# EAGLE schematic c421 (EAGLE 6.6.0)

## Sheet 1 of 2
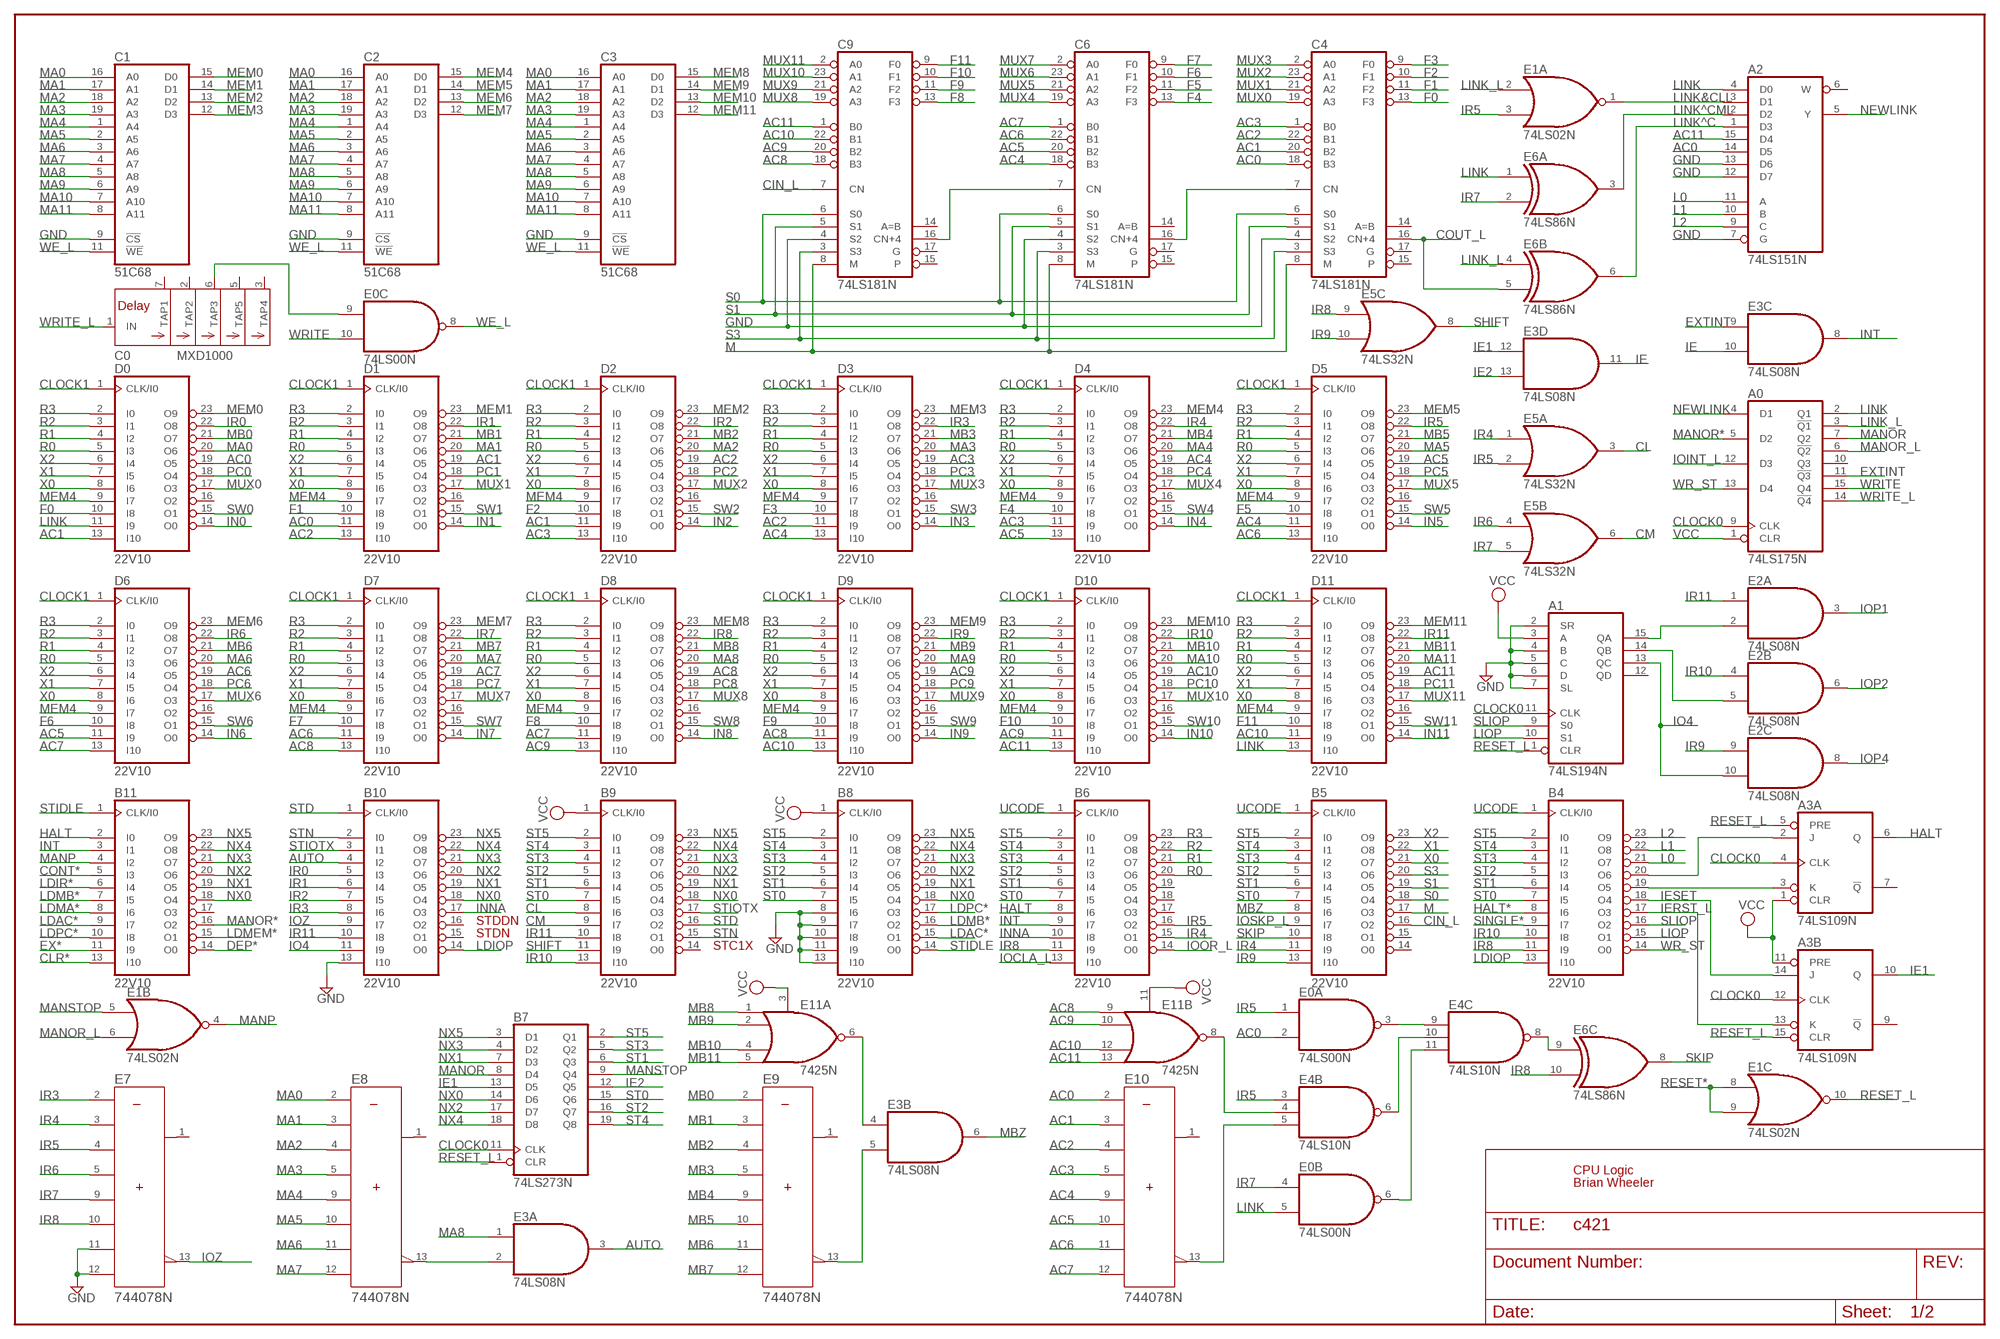
[diagram p0: schematic, sheet 1]

### Parts
A0  74LS175N  [DIL16]
A1  74LS194N  74S194N  [DIL16]
A2  74LS151N  [DIL16]
A3  74LS109N  [DIL16]
B4  22V10  [DIL24-3]
B5  22V10  [DIL24-3]
B6  22V10  [DIL24-3]
B7  74LS273N  74273N  [DIL20]
B8  22V10  [DIL24-3]
B9  22V10  [DIL24-3]
B10  22V10  [DIL24-3]
B11  22V10  [DIL24-3]
C0  MXD1000  [DIL08]
C1  51C68  [DIL20]
C2  51C68  [DIL20]
C3  51C68  [DIL20]
C4  74LS181N  [DIL24-6]
C6  74LS181N  [DIL24-6]
C9  74LS181N  [DIL24-6]
D0  22V10  [DIL24-3]
D1  22V10  [DIL24-3]
D2  22V10  [DIL24-3]
D3  22V10  [DIL24-3]
D4  22V10  [DIL24-3]
D5  22V10  [DIL24-3]
D6  22V10  [DIL24-3]
D7  22V10  [DIL24-3]
D8  22V10  [DIL24-3]
D9  22V10  [DIL24-3]
D10  22V10  [DIL24-3]
D11  22V10  [DIL24-3]
E0  74LS00N  [DIL14]
E1  74LS02N  [DIL14]
E2  74LS08N  [DIL14]
E3  74LS08N  [DIL14]
E4  74LS10N  [DIL14]
E5  74LS32N  [DIL14]
E6  74LS86N  [DIL14]
E7  744078N  [DIL14]
E8  744078N  [DIL14]
E9  744078N  [DIL14]
E10  744078N  [DIL14]
E11  7425N  [DIL14]

### Nets
AC0: A2.14(D5) C4.18(B3) D0.19(O5) D1.11(I9) E0.2(A:I1) E10.2(A) ; also sheet 2
AC1: C4.20(B2) D0.13(I10) D1.19(O5) D2.11(I9) E10.3(B) ; also sheet 2
AC2: C4.22(B1) D1.13(I10) D2.19(O5) D3.11(I9) E10.4(C) ; also sheet 2
AC3: C4.1(B0) D2.13(I10) D3.19(O5) D4.11(I9) E10.5(D) ; also sheet 2
AC4: C6.18(B3) D3.13(I10) D4.19(O5) D5.11(I9) E10.9(E) ; also sheet 2
AC5: C6.20(B2) D4.13(I10) D5.19(O5) D6.11(I9) E10.10(F) ; also sheet 2
AC6: C6.22(B1) D5.13(I10) D6.19(O5) D7.11(I9) E10.11(G) ; also sheet 2
AC7: C6.1(B0) D6.13(I10) D7.19(O5) D8.11(I9) E10.12(H) ; also sheet 2
AC8: C9.18(B3) D7.13(I10) D8.19(O5) D9.11(I9) E11.9(B:I0) ; also sheet 2
AC9: C9.20(B2) D8.13(I10) D9.19(O5) D10.11(I9) E11.10(B:I1) ; also sheet 2
AC10: C9.22(B1) D9.13(I10) D10.19(O5) D11.11(I9) E11.12(B:I2) ; also sheet 2
AC11: A2.15(D4) C9.1(B0) D10.13(I10) D11.19(O5) E11.13(B:I3) ; also sheet 2
AUTO: B10.4(I2) E3.3(A:O)
CIN_L: B5.16(O2) C9.7(CN) ; also sheet 2
CL: B9.8(I6) E5.3(A:O)
CLOCK0: A0.9(CLK) A1.11(CLK) A3.4(A:CLK) A3.12(B:CLK) B7.11(CLK) ; also sheet 2
CLOCK1: D0.1(CLK/I0) D1.1(CLK/I0) D2.1(CLK/I0) D3.1(CLK/I0) D4.1(CLK/I0) D5.1(CLK/I0) D6.1(CLK/I0) D7.1(CLK/I0) D8.1(CLK/I0) D9.1(CLK/I0) D10.1(CLK/I0) D11.1(CLK/I0) ; also sheet 2
CLR*: B11.13(I10) ; also sheet 2
CM: B9.9(I7) E5.6(B:O)
CONT*: B11.5(I3) ; also sheet 2
COUT_L: C4.16(CN+4) E6.5(B:I1)
DEP*: B11.14(O0) ; also sheet 2
EX*: B11.11(I9) ; also sheet 2
EXTINT: A0.11(!Q3) E3.9(C:I0)
F0: C4.13(F3) D0.10(I8)
F1: C4.11(F2) D1.10(I8)
F2: C4.10(F1) D2.10(I8)
F3: C4.9(F0) D3.10(I8)
F4: C6.13(F3) D4.10(I8)
F5: C6.11(F2) D5.10(I8)
F6: C6.10(F1) D6.10(I8)
F7: C6.9(F0) D7.10(I8)
F8: C9.13(F3) D8.10(I8)
F9: C9.11(F2) D9.10(I8)
F10: C9.10(F1) D10.10(I8)
F11: C9.9(F0) D11.10(I8)
GND [Power]: A1.2(SR) A1.4(B) A1.5(C) A1.6(D) A1.7(SL) A2.7(G) A2.12(D7) A2.13(D6) B8.8(I6) B8.9(I7) B8.10(I8) B8.11(I9) B8.13(I10) B10.13(I10) C1.9(!CS) C2.9(!CS) C3.9(!CS) C4.4(S2) C6.4(S2) C9.4(S2) E7.11(G) E7.12(H) ; also sheet 2
HALT: A3.6(A:Q) B6.8(I6) B11.2(I0) ; also sheet 2
HALT*: B4.8(I6) ; also sheet 2
IE: E3.10(C:I1) E3.11(D:O)
IE1: A3.10(B:Q) B7.13(D5) E3.12(D:I0)
IE2: B7.12(Q5) E3.13(D:I1)
IERST_L: A3.13(B:K) B4.17(O3)
IESET: A3.14(B:J) B4.18(O4)
IN0: D0.14(O0) ; also sheet 2
IN1: D1.14(O0) ; also sheet 2
IN2: D2.14(O0) ; also sheet 2
IN3: D3.14(O0) ; also sheet 2
IN4: D4.14(O0) ; also sheet 2
IN5: D5.14(O0) ; also sheet 2
IN6: D6.14(O0) ; also sheet 2
IN7: D7.14(O0) ; also sheet 2
IN8: D8.14(O0) ; also sheet 2
IN9: D9.14(O0) ; also sheet 2
IN10: D10.14(O0) ; also sheet 2
IN11: D11.14(O0) ; also sheet 2
INNA: B6.10(I8) B10.17(O3)
INT: B6.9(I7) B11.3(I1) E3.8(C:O)
IO4: A1.13(QC) B10.11(I9) E2.10(C:I1)
IOCLA_L: B6.13(I10) ; also sheet 2
IOINT_L: A0.12(D3) ; also sheet 2
IOOR_L: B6.14(O0) ; also sheet 2
IOP1: E2.3(A:O) ; also sheet 2
IOP2: E2.6(B:O) ; also sheet 2
IOP4: E2.8(C:O) ; also sheet 2
IOSKP_L: B5.9(I7) ; also sheet 2
IOZ: B10.9(I7) E7.13(W)
IR0: B10.5(I3) D0.22(O8) ; also sheet 2
IR1: B10.6(I4) D1.22(O8) ; also sheet 2
IR2: B10.7(I5) D2.22(O8) ; also sheet 2
IR3: B10.8(I6) D3.22(O8) E7.2(A) ; also sheet 2
IR4: B5.11(I9) B6.15(O1) D4.22(O8) E5.1(A:I0) E7.3(B) ; also sheet 2
IR5: B6.16(O2) D5.22(O8) E0.1(A:I0) E1.3(A:I1) E4.3(B:I0) E5.2(A:I1) E7.4(C) ; also sheet 2
IR6: D6.22(O8) E5.4(B:I0) E7.5(D) ; also sheet 2
IR7: D7.22(O8) E0.4(B:I0) E5.5(B:I1) E6.2(A:I1) E7.9(E) ; also sheet 2
IR8: B4.11(I9) B6.11(I9) D8.22(O8) E5.9(C:I0) E6.10(C:I1) E7.10(F) ; also sheet 2
IR9: B5.13(I10) D9.22(O8) E2.9(C:I0) E5.10(C:I1) ; also sheet 2
IR10: B4.10(I8) B9.13(I10) D10.22(O8) E2.4(B:I0) ; also sheet 2
IR11: B9.10(I8) B10.10(I8) D11.22(O8) E2.1(A:I0) ; also sheet 2
L0: A2.11(A) B4.21(O7) ; also sheet 2
L1: A2.10(B) B4.22(O8) ; also sheet 2
L2: A2.9(C) B4.23(O9) ; also sheet 2
LDAC*: B8.15(O1) B11.9(I7) ; also sheet 2
LDIOP: B4.13(I10) B10.14(O0)
LDIR*: B11.6(I4) ; also sheet 2
LDMA*: B11.8(I6) ; also sheet 2
LDMB*: B8.16(O2) B11.7(I5) ; also sheet 2
LDMEM*: B11.15(O1) ; also sheet 2
LDPC*: B8.17(O3) B11.10(I8) ; also sheet 2
LINK: A0.2(Q1) A2.4(D0) D0.11(I9) D11.13(I10) E0.5(B:I1) E6.1(A:I0) ; also sheet 2
LINK&CLL: A2.3(D1) E1.1(A:O)
LINK^C: A2.1(D3) E6.6(B:O)
LINK^CML: A2.2(D2) E6.3(A:O)
LINK_L: A0.3(!Q1) E1.2(A:I0) E6.4(B:I0)
LIOP: A1.10(S1) B4.15(O1)
M: B5.17(O3) C4.8(M) C6.8(M) C9.8(M) ; also sheet 2
MA0: C1.16(A0) C2.16(A0) C3.16(A0) D0.20(O6) E8.2(A) ; also sheet 2
MA1: C1.17(A1) C2.17(A1) C3.17(A1) D1.20(O6) E8.3(B) ; also sheet 2
MA2: C1.18(A2) C2.18(A2) C3.18(A2) D2.20(O6) E8.4(C) ; also sheet 2
MA3: C1.19(A3) C2.19(A3) C3.19(A3) D3.20(O6) E8.5(D) ; also sheet 2
MA4: C1.1(A4) C2.1(A4) C3.1(A4) D4.20(O6) E8.9(E) ; also sheet 2
MA5: C1.2(A5) C2.2(A5) C3.2(A5) D5.20(O6) E8.10(F) ; also sheet 2
MA6: C1.3(A6) C2.3(A6) C3.3(A6) D6.20(O6) E8.11(G) ; also sheet 2
MA7: C1.4(A7) C2.4(A7) C3.4(A7) D7.20(O6) E8.12(H) ; also sheet 2
MA8: C1.5(A8) C2.5(A8) C3.5(A8) D8.20(O6) E3.1(A:I0) ; also sheet 2
MA9: C1.6(A9) C2.6(A9) C3.6(A9) D9.20(O6) ; also sheet 2
MA10: C1.7(A10) C2.7(A10) C3.7(A10) D10.20(O6) ; also sheet 2
MA11: C1.8(A11) C2.8(A11) C3.8(A11) D11.20(O6) ; also sheet 2
MANOR: A0.7(Q2) B7.8(D4)
MANOR*: A0.5(D2) B11.16(O2) ; also sheet 2
MANOR_L: A0.6(!Q2) E1.6(B:I1)
MANP: B11.4(I2) E1.4(B:O)
MANSTOP: B7.9(Q4) E1.5(B:I0)
MB0: D0.21(O7) E9.2(A) ; also sheet 2
MB1: D1.21(O7) E9.3(B) ; also sheet 2
MB2: D2.21(O7) E9.4(C) ; also sheet 2
MB3: D3.21(O7) E9.5(D) ; also sheet 2
MB4: D4.21(O7) E9.9(E) ; also sheet 2
MB5: D5.21(O7) E9.10(F) ; also sheet 2
MB6: D6.21(O7) E9.11(G) ; also sheet 2
MB7: D7.21(O7) E9.12(H) ; also sheet 2
MB8: D8.21(O7) E11.1(A:I0) ; also sheet 2
MB9: D9.21(O7) E11.2(A:I1) ; also sheet 2
MB10: D10.21(O7) E11.4(A:I2) ; also sheet 2
MB11: D11.21(O7) E11.5(A:I3) ; also sheet 2
MBZ: B5.8(I6) E3.6(B:O)
MEM0: C1.15(D0) D0.23(O9) ; also sheet 2
MEM1: C1.14(D1) D1.23(O9) ; also sheet 2
MEM2: C1.13(D2) D2.23(O9) ; also sheet 2
MEM3: C1.12(D3) D3.23(O9) ; also sheet 2
MEM4: C2.15(D0) D0.9(I7) D1.9(I7) D2.9(I7) D3.9(I7) D4.9(I7) D4.23(O9) D5.9(I7) D6.9(I7) D7.9(I7) D8.9(I7) D9.9(I7) D10.9(I7) D11.9(I7) ; also sheet 2
MEM5: C2.14(D1) D5.23(O9) ; also sheet 2
MEM6: C2.13(D2) D6.23(O9) ; also sheet 2
MEM7: C2.12(D3) D7.23(O9) ; also sheet 2
MEM8: C3.15(D0) D8.23(O9) ; also sheet 2
MEM9: C3.14(D1) D9.23(O9) ; also sheet 2
MEM10: C3.13(D2) D10.23(O9) ; also sheet 2
MEM11: C3.12(D3) D11.23(O9) ; also sheet 2
MUX0: C4.19(A3) D0.17(O3)
MUX1: C4.21(A2) D1.17(O3)
MUX2: C4.23(A1) D2.17(O3)
MUX3: C4.2(A0) D3.17(O3)
MUX4: C6.19(A3) D4.17(O3)
MUX5: C6.21(A2) D5.17(O3)
MUX6: C6.23(A1) D6.17(O3)
MUX7: C6.2(A0) D7.17(O3)
MUX8: C9.19(A3) D8.17(O3)
MUX9: C9.21(A2) D9.17(O3)
MUX10: C9.23(A1) D10.17(O3)
MUX11: C9.2(A0) D11.17(O3)
N$1: C4.7(CN) C6.16(CN+4)
N$2: E3.2(A:I1) E8.13(W)
N$3: E4.4(B:I1) E11.8(B:O)
N$4: E4.5(B:I2) E10.13(W)
N$5: E4.8(C:O) E6.9(C:I0)
N$6: C0.6(TAP3) E0.9(C:I0)
N$7: E3.4(B:I0) E11.6(A:O)
N$8: E3.5(B:I1) E9.13(W)
N$9: A1.15(QA) E2.2(A:I1)
N$10: A1.14(QB) E2.5(B:I1)
N$11: E0.6(B:O) E4.11(C:I2)
N$12: E4.6(B:O) E4.10(C:I1)
N$13: E0.3(A:O) E4.9(C:I0)
N$15: C6.7(CN) C9.16(CN+4)
N$17: A3.3(A:K) B4.19(O5)
N$18: A3.2(A:J) B4.20(O6)
NEWLINK: A0.4(D1) A2.5(Y)
NX0: B7.14(D6) B8.18(O4) B9.18(O4) B10.18(O4) B11.18(O4) ; also sheet 2
NX1: B7.7(D3) B8.19(O5) B9.19(O5) B10.19(O5) B11.19(O5) ; also sheet 2
NX2: B7.17(D7) B8.20(O6) B9.20(O6) B10.20(O6) B11.20(O6) ; also sheet 2
NX3: B7.4(D2) B8.21(O7) B9.21(O7) B10.21(O7) B11.21(O7) ; also sheet 2
NX4: B7.18(D8) B8.22(O8) B9.22(O8) B10.22(O8) B11.22(O8) ; also sheet 2
NX5: B7.3(D1) B8.23(O9) B9.23(O9) B10.23(O9) B11.23(O9) ; also sheet 2
PC0: D0.18(O4) ; also sheet 2
PC1: D1.18(O4) ; also sheet 2
PC2: D2.18(O4) ; also sheet 2
PC3: D3.18(O4) ; also sheet 2
PC4: D4.18(O4) ; also sheet 2
PC5: D5.18(O4) ; also sheet 2
PC6: D6.18(O4) ; also sheet 2
PC7: D7.18(O4) ; also sheet 2
PC8: D8.18(O4) ; also sheet 2
PC9: D9.18(O4) ; also sheet 2
PC10: D10.18(O4) ; also sheet 2
PC11: D11.18(O4) ; also sheet 2
R0: B6.20(O6) D0.5(I3) D1.5(I3) D2.5(I3) D3.5(I3) D4.5(I3) D5.5(I3) D6.5(I3) D7.5(I3) D8.5(I3) D9.5(I3) D10.5(I3) D11.5(I3) ; also sheet 2
R1: B6.21(O7) D0.4(I2) D1.4(I2) D2.4(I2) D3.4(I2) D4.4(I2) D5.4(I2) D6.4(I2) D7.4(I2) D8.4(I2) D9.4(I2) D10.4(I2) D11.4(I2) ; also sheet 2
R2: B6.22(O8) D0.3(I1) D1.3(I1) D2.3(I1) D3.3(I1) D4.3(I1) D5.3(I1) D6.3(I1) D7.3(I1) D8.3(I1) D9.3(I1) D10.3(I1) D11.3(I1) ; also sheet 2
R3: B6.23(O9) D0.2(I0) D1.2(I0) D2.2(I0) D3.2(I0) D4.2(I0) D5.2(I0) D6.2(I0) D7.2(I0) D8.2(I0) D9.2(I0) D10.2(I0) D11.2(I0) ; also sheet 2
RESET*: E1.8(C:I0) E1.9(C:I1) ; also sheet 2
RESET_L: A1.1(CLR) A3.5(A:PRE) A3.15(B:CLR) B7.1(CLR) E1.10(C:O)
S0: B5.18(O4) C4.6(S0) C6.6(S0) C9.6(S0) ; also sheet 2
S1: B5.19(O5) C4.5(S1) C6.5(S1) C9.5(S1) ; also sheet 2
S3: B5.20(O6) C4.3(S3) C6.3(S3) C9.3(S3) ; also sheet 2
SHIFT: B9.11(I9) E5.8(C:O)
SINGLE*: B4.9(I7) ; also sheet 2
SKIP: B5.10(I8) E6.8(C:O)
SLIOP: A1.9(S0) B4.16(O2)
ST0: B4.7(I5) B5.7(I5) B6.7(I5) B7.15(Q6) B8.7(I5) B9.7(I5) ; also sheet 2
ST1: B4.6(I4) B5.6(I4) B6.6(I4) B7.6(Q3) B8.6(I4) B9.6(I4) ; also sheet 2
ST2: B4.5(I3) B5.5(I3) B6.5(I3) B7.16(Q7) B8.5(I3) B9.5(I3) ; also sheet 2
ST3: B4.4(I2) B5.4(I2) B6.4(I2) B7.5(Q2) B8.4(I2) B9.4(I2) ; also sheet 2
ST4: B4.3(I1) B5.3(I1) B6.3(I1) B7.19(Q8) B8.3(I1) B9.3(I1) ; also sheet 2
ST5: B4.2(I0) B5.2(I0) B6.2(I0) B7.2(Q1) B8.2(I0) B9.2(I0) ; also sheet 2
STD: B9.16(O2) B10.1(CLK/I0)
STIDLE: B8.14(O0) B11.1(CLK/I0)
STIOTX: B9.17(O3) B10.3(I1)
STN: B9.15(O1) B10.2(I0)
SW0: D0.15(O1) ; also sheet 2
SW1: D1.15(O1) ; also sheet 2
SW2: D2.15(O1) ; also sheet 2
SW3: D3.15(O1) ; also sheet 2
SW4: D4.15(O1) ; also sheet 2
SW5: D5.15(O1) ; also sheet 2
SW6: D6.15(O1) ; also sheet 2
SW7: D7.15(O1) ; also sheet 2
SW8: D8.15(O1) ; also sheet 2
SW9: D9.15(O1) ; also sheet 2
SW10: D10.15(O1) ; also sheet 2
SW11: D11.15(O1) ; also sheet 2
UCODE: B4.1(CLK/I0) B5.1(CLK/I0) B6.1(CLK/I0) ; also sheet 2
VCC [Power]: A0.1(CLR) A1.3(A) A3.1(A:CLR) A3.11(B:PRE) B8.1(CLK/I0) B9.1(CLK/I0) E11.3(A:G) E11.11(B:G) ; also sheet 2
WE_L: C1.11(!WE) C2.11(!WE) C3.11(!WE) E0.8(C:O)
WR_ST: A0.13(D4) B4.14(O0)
WRITE: A0.15(Q4) E0.10(C:I1)
WRITE_L: A0.14(!Q4) C0.1(IN)
X0: B5.21(O7) D0.8(I6) D1.8(I6) D2.8(I6) D3.8(I6) D4.8(I6) D5.8(I6) D6.8(I6) D7.8(I6) D8.8(I6) D9.8(I6) D10.8(I6) D11.8(I6) ; also sheet 2
X1: B5.22(O8) D0.7(I5) D1.7(I5) D2.7(I5) D3.7(I5) D4.7(I5) D5.7(I5) D6.7(I5) D7.7(I5) D8.7(I5) D9.7(I5) D10.7(I5) D11.7(I5) ; also sheet 2
X2: B5.23(O9) D0.6(I4) D1.6(I4) D2.6(I4) D3.6(I4) D4.6(I4) D5.6(I4) D6.6(I4) D7.6(I4) D8.6(I4) D9.6(I4) D10.6(I4) D11.6(I4) ; also sheet 2
Unconnected: A0.10(Q3) A1.12(QD) A2.6(W) A3.7(A:!Q) A3.9(B:!Q) B5.14(O0) B5.15(O1) B6.17(O3) B6.18(O4) B6.19(O5) B9.14(O0) B10.15(O1) B10.16(O2) B11.17(O3) C0.2(TAP2) C0.3(TAP4) C0.5(TAP5) C0.7(TAP1) C4.14(A=B) C4.15(P) C4.17(G) C6.14(A=B) C6.15(P) C6.17(G) C9.14(A=B) C9.15(P) C9.17(G) D0.16(O2) D1.16(O2) D2.16(O2) D3.16(O2) D4.16(O2) D5.16(O2) D6.16(O2) D7.16(O2) D8.16(O2) D9.16(O2) D10.16(O2) D11.16(O2) E0.11(D:O) E0.12(D:I0) E0.13(D:I1) E1.11(D:I0) E1.12(D:I1) E1.13(D:O) E2.11(D:O) E2.12(D:I0) E2.13(D:I1) E4.1(A:I0) E4.2(A:I1) E4.12(A:O) E4.13(A:I2) E5.11(D:O) E5.12(D:I0) E5.13(D:I1) E6.11(D:O) E6.12(D:I0) E6.13(D:I1) E7.1(Y) E8.1(Y) E9.1(Y) E10.1(Y)

### Notes on the sheet
- STDDN
- STDN
- STC1X
- CPU Logic
- Brian Wheeler

## Sheet 2 of 2
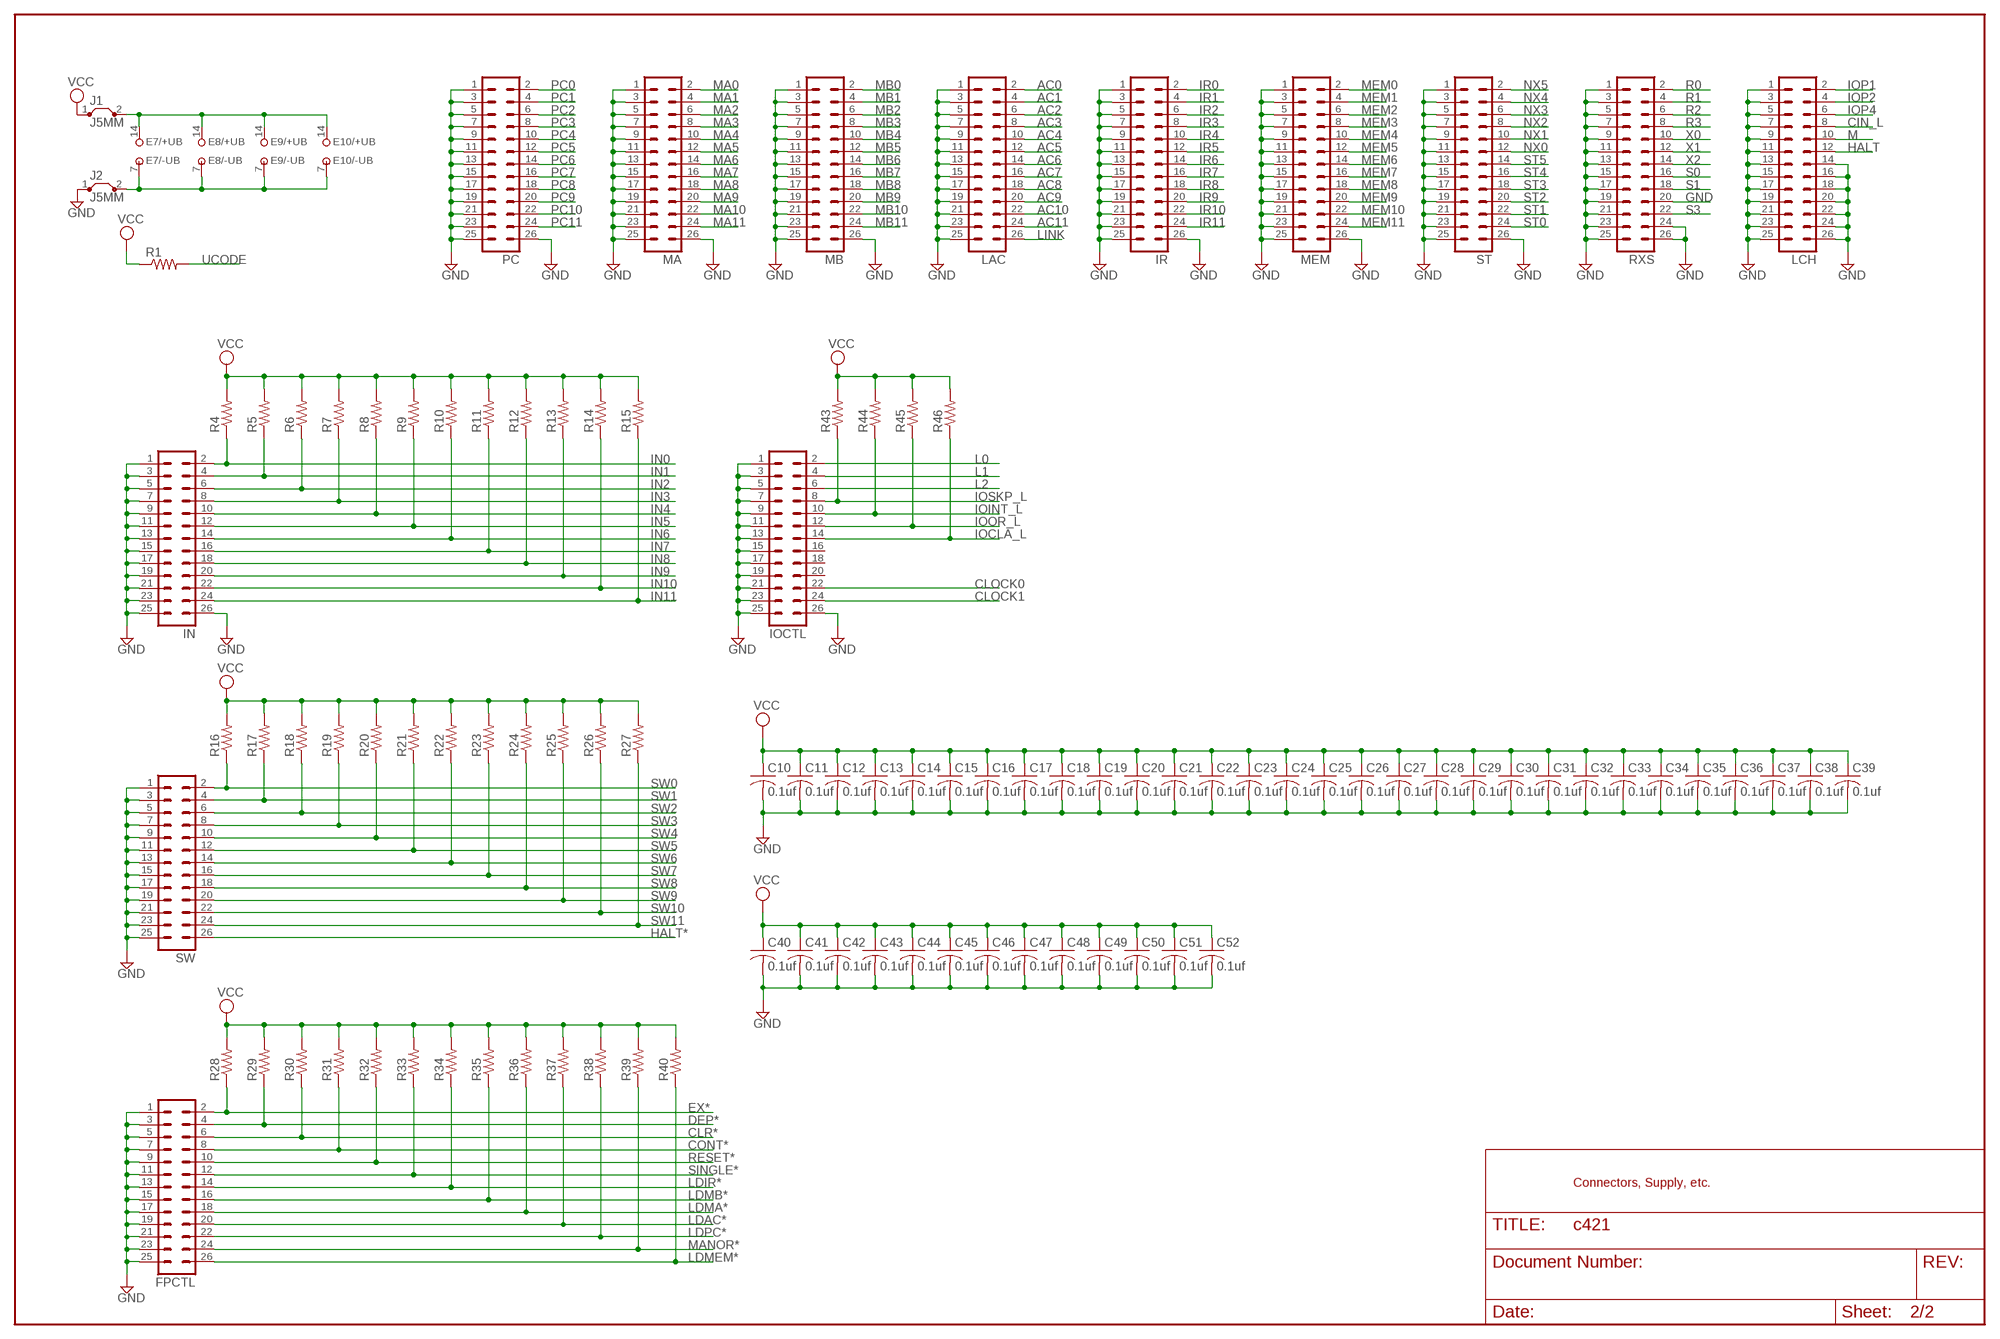
[diagram p1: schematic, sheet 2]

### Parts
C10  0.1uf  C-US050-025X075  [C050-025X075]
C11  0.1uf  C-US050-025X075  [C050-025X075]
C12  0.1uf  C-US050-025X075  [C050-025X075]
C13  0.1uf  C-US050-025X075  [C050-025X075]
C14  0.1uf  C-US050-025X075  [C050-025X075]
C15  0.1uf  C-US050-025X075  [C050-025X075]
C16  0.1uf  C-US050-025X075  [C050-025X075]
C17  0.1uf  C-US050-025X075  [C050-025X075]
C18  0.1uf  C-US050-025X075  [C050-025X075]
C19  0.1uf  C-US050-025X075  [C050-025X075]
C20  0.1uf  C-US050-025X075  [C050-025X075]
C21  0.1uf  C-US050-025X075  [C050-025X075]
C22  0.1uf  C-US050-025X075  [C050-025X075]
C23  0.1uf  C-US050-025X075  [C050-025X075]
C24  0.1uf  C-US050-025X075  [C050-025X075]
C25  0.1uf  C-US050-025X075  [C050-025X075]
C26  0.1uf  C-US050-025X075  [C050-025X075]
C27  0.1uf  C-US050-025X075  [C050-025X075]
C28  0.1uf  C-US050-025X075  [C050-025X075]
C29  0.1uf  C-US050-025X075  [C050-025X075]
C30  0.1uf  C-US050-025X075  [C050-025X075]
C31  0.1uf  C-US050-025X075  [C050-025X075]
C32  0.1uf  C-US050-025X075  [C050-025X075]
C33  0.1uf  C-US050-025X075  [C050-025X075]
C34  0.1uf  C-US050-025X075  [C050-025X075]
C35  0.1uf  C-US050-025X075  [C050-025X075]
C36  0.1uf  C-US050-025X075  [C050-025X075]
C37  0.1uf  C-US050-025X075  [C050-025X075]
C38  0.1uf  C-US050-025X075  [C050-025X075]
C39  0.1uf  C-US050-025X075  [C050-025X075]
C40  0.1uf  C-US050-025X075  [C050-025X075]
C41  0.1uf  C-US050-025X075  [C050-025X075]
C42  0.1uf  C-US050-025X075  [C050-025X075]
C43  0.1uf  C-US050-025X075  [C050-025X075]
C44  0.1uf  C-US050-025X075  [C050-025X075]
C45  0.1uf  C-US050-025X075  [C050-025X075]
C46  0.1uf  C-US050-025X075  [C050-025X075]
C47  0.1uf  C-US050-025X075  [C050-025X075]
C48  0.1uf  C-US050-025X075  [C050-025X075]
C49  0.1uf  C-US050-025X075  [C050-025X075]
C50  0.1uf  C-US050-025X075  [C050-025X075]
C51  0.1uf  C-US050-025X075  [C050-025X075]
C52  0.1uf  C-US050-025X075  [C050-025X075]
FPCTL  ML26  [ML26]
IN  ML26  [ML26]
IOCTL  ML26  [ML26]
IR  ML26  [ML26]
J1  J5MM  [05]
J2  J5MM  [05]
LAC  ML26  [ML26]
LCH  ML26  [ML26]
MA  ML26  [ML26]
MB  ML26  [ML26]
MEM  ML26  [ML26]
PC  ML26  [ML26]
R1  R-US_0207/10  [0207/10]
R4  R-US_0207/10  [0207/10]
R5  R-US_0207/10  [0207/10]
R6  R-US_0207/10  [0207/10]
R7  R-US_0207/10  [0207/10]
R8  R-US_0207/10  [0207/10]
R9  R-US_0207/10  [0207/10]
R10  R-US_0207/10  [0207/10]
R11  R-US_0207/10  [0207/10]
R12  R-US_0207/10  [0207/10]
R13  R-US_0207/10  [0207/10]
R14  R-US_0207/10  [0207/10]
R15  R-US_0207/10  [0207/10]
R16  R-US_0207/10  [0207/10]
R17  R-US_0207/10  [0207/10]
R18  R-US_0207/10  [0207/10]
R19  R-US_0207/10  [0207/10]
R20  R-US_0207/10  [0207/10]
R21  R-US_0207/10  [0207/10]
R22  R-US_0207/10  [0207/10]
R23  R-US_0207/10  [0207/10]
R24  R-US_0207/10  [0207/10]
R25  R-US_0207/10  [0207/10]
R26  R-US_0207/10  [0207/10]
R27  R-US_0207/10  [0207/10]
R28  R-US_0207/10  [0207/10]
R29  R-US_0207/10  [0207/10]
R30  R-US_0207/10  [0207/10]
R31  R-US_0207/10  [0207/10]
R32  R-US_0207/10  [0207/10]
R33  R-US_0207/10  [0207/10]
R34  R-US_0207/10  [0207/10]
R35  R-US_0207/10  [0207/10]
R36  R-US_0207/10  [0207/10]
R37  R-US_0207/10  [0207/10]
R38  R-US_0207/10  [0207/10]
R39  R-US_0207/10  [0207/10]
R40  R-US_0207/10  [0207/10]
R43  R-US_0207/10  [0207/10]
R44  R-US_0207/10  [0207/10]
R45  R-US_0207/10  [0207/10]
R46  R-US_0207/10  [0207/10]
RXS  ML26  [ML26]
ST  ML26  [ML26]
SW  ML26  [ML26]

### Nets
+UB [Power]: E7.14(+UB) E8.14(+UB) E9.14(+UB) E10.14(+UB) J1.2
-UB [Power]: E7.7(-UB) E8.7(-UB) E9.7(-UB) E10.7(-UB) J2.2
AC0: LAC.2 ; also sheet 1
AC1: LAC.4 ; also sheet 1
AC2: LAC.6 ; also sheet 1
AC3: LAC.8 ; also sheet 1
AC4: LAC.10 ; also sheet 1
AC5: LAC.12 ; also sheet 1
AC6: LAC.14 ; also sheet 1
AC7: LAC.16 ; also sheet 1
AC8: LAC.18 ; also sheet 1
AC9: LAC.20 ; also sheet 1
AC10: LAC.22 ; also sheet 1
AC11: LAC.24 ; also sheet 1
CIN_L: LCH.8 ; also sheet 1
CLOCK0: IOCTL.22 ; also sheet 1
CLOCK1: IOCTL.24 ; also sheet 1
CLR*: FPCTL.6 R30.1 ; also sheet 1
CONT*: FPCTL.8 R31.1 ; also sheet 1
DEP*: FPCTL.4 R29.1 ; also sheet 1
EX*: FPCTL.2 R28.1 ; also sheet 1
GND [Power]: C10.2 C11.2 C12.2 C13.2 C14.2 C15.2 C16.2 C17.2 C18.2 C19.2 C20.2 C21.2 C22.2 C23.2 C24.2 C25.2 C26.2 C27.2 C28.2 C29.2 C30.2 C31.2 C32.2 C33.2 C34.2 C35.2 C36.2 C37.2 C38.2 C39.2 C40.2 C41.2 C42.2 C43.2 C44.2 C45.2 C46.2 C47.2 C48.2 C49.2 C50.2 C51.2 C52.2 FPCTL.1 FPCTL.3 FPCTL.5 FPCTL.7 FPCTL.9 FPCTL.11 FPCTL.13 FPCTL.15 FPCTL.17 FPCTL.19 FPCTL.21 FPCTL.23 FPCTL.25 IN.1 IN.3 IN.5 IN.7 IN.9 IN.11 IN.13 IN.15 IN.17 IN.19 IN.21 IN.23 IN.25 IN.26 IOCTL.1 IOCTL.3 IOCTL.5 IOCTL.7 IOCTL.9 IOCTL.11 IOCTL.13 IOCTL.15 IOCTL.17 IOCTL.19 IOCTL.21 IOCTL.23 IOCTL.25 IOCTL.26 IR.1 IR.3 IR.5 IR.7 IR.9 IR.11 IR.13 IR.15 IR.17 IR.19 IR.21 IR.23 IR.25 IR.26 J2.1 LAC.1 LAC.3 LAC.5 LAC.7 LAC.9 LAC.11 LAC.13 LAC.15 LAC.17 LAC.19 LAC.21 LAC.23 LAC.25 LCH.1 LCH.3 LCH.5 LCH.7 LCH.9 LCH.11 LCH.13 LCH.14 LCH.15 LCH.16 LCH.17 LCH.18 LCH.19 LCH.20 LCH.21 LCH.22 LCH.23 LCH.24 LCH.25 LCH.26 MA.1 MA.3 MA.5 MA.7 MA.9 MA.11 MA.13 MA.15 MA.17 MA.19 MA.21 MA.23 MA.25 MA.26 MB.1 MB.3 MB.5 MB.7 MB.9 MB.11 MB.13 MB.15 MB.17 MB.19 MB.21 MB.23 MB.25 MB.26 MEM.1 MEM.3 MEM.5 MEM.7 MEM.9 MEM.11 MEM.13 MEM.15 MEM.17 MEM.19 MEM.21 MEM.23 MEM.25 MEM.26 PC.1 PC.3 PC.5 PC.7 PC.9 PC.11 PC.13 PC.15 PC.17 PC.19 PC.21 PC.23 PC.25 PC.26 RXS.1 RXS.3 RXS.5 RXS.7 RXS.9 RXS.11 RXS.13 RXS.15 RXS.17 RXS.19 RXS.20 RXS.21 RXS.23 RXS.24 RXS.25 RXS.26 ST.1 ST.3 ST.5 ST.7 ST.9 ST.11 ST.13 ST.15 ST.17 ST.19 ST.21 ST.23 ST.25 ST.26 SW.1 SW.3 SW.5 SW.7 SW.9 SW.11 SW.13 SW.15 SW.17 SW.19 SW.21 SW.23 SW.25 ; also sheet 1
HALT: LCH.12 ; also sheet 1
HALT*: SW.26 ; also sheet 1
IN0: IN.2 R4.1 ; also sheet 1
IN1: IN.4 R5.1 ; also sheet 1
IN2: IN.6 R6.1 ; also sheet 1
IN3: IN.8 R7.1 ; also sheet 1
IN4: IN.10 R8.1 ; also sheet 1
IN5: IN.12 R9.1 ; also sheet 1
IN6: IN.14 R10.1 ; also sheet 1
IN7: IN.16 R11.1 ; also sheet 1
IN8: IN.18 R12.1 ; also sheet 1
IN9: IN.20 R13.1 ; also sheet 1
IN10: IN.22 R14.1 ; also sheet 1
IN11: IN.24 R15.1 ; also sheet 1
IOCLA_L: IOCTL.14 R46.1 ; also sheet 1
IOINT_L: IOCTL.10 R44.1 ; also sheet 1
IOOR_L: IOCTL.12 R45.1 ; also sheet 1
IOP1: LCH.2 ; also sheet 1
IOP2: LCH.4 ; also sheet 1
IOP4: LCH.6 ; also sheet 1
IOSKP_L: IOCTL.8 R43.1 ; also sheet 1
IR0: IR.2 ; also sheet 1
IR1: IR.4 ; also sheet 1
IR2: IR.6 ; also sheet 1
IR3: IR.8 ; also sheet 1
IR4: IR.10 ; also sheet 1
IR5: IR.12 ; also sheet 1
IR6: IR.14 ; also sheet 1
IR7: IR.16 ; also sheet 1
IR8: IR.18 ; also sheet 1
IR9: IR.20 ; also sheet 1
IR10: IR.22 ; also sheet 1
IR11: IR.24 ; also sheet 1
L0: IOCTL.2 ; also sheet 1
L1: IOCTL.4 ; also sheet 1
L2: IOCTL.6 ; also sheet 1
LDAC*: FPCTL.20 R37.1 ; also sheet 1
LDIR*: FPCTL.14 R34.1 ; also sheet 1
LDMA*: FPCTL.18 R36.1 ; also sheet 1
LDMB*: FPCTL.16 R35.1 ; also sheet 1
LDMEM*: FPCTL.26 R40.1 ; also sheet 1
LDPC*: FPCTL.22 R38.1 ; also sheet 1
LINK: LAC.26 ; also sheet 1
M: LCH.10 ; also sheet 1
MA0: MA.2 ; also sheet 1
MA1: MA.4 ; also sheet 1
MA2: MA.6 ; also sheet 1
MA3: MA.8 ; also sheet 1
MA4: MA.10 ; also sheet 1
MA5: MA.12 ; also sheet 1
MA6: MA.14 ; also sheet 1
MA7: MA.16 ; also sheet 1
MA8: MA.18 ; also sheet 1
MA9: MA.20 ; also sheet 1
MA10: MA.22 ; also sheet 1
MA11: MA.24 ; also sheet 1
MANOR*: FPCTL.24 R39.1 ; also sheet 1
MB0: MB.2 ; also sheet 1
MB1: MB.4 ; also sheet 1
MB2: MB.6 ; also sheet 1
MB3: MB.8 ; also sheet 1
MB4: MB.10 ; also sheet 1
MB5: MB.12 ; also sheet 1
MB6: MB.14 ; also sheet 1
MB7: MB.16 ; also sheet 1
MB8: MB.18 ; also sheet 1
MB9: MB.20 ; also sheet 1
MB10: MB.22 ; also sheet 1
MB11: MB.24 ; also sheet 1
MEM0: MEM.2 ; also sheet 1
MEM1: MEM.4 ; also sheet 1
MEM2: MEM.6 ; also sheet 1
MEM3: MEM.8 ; also sheet 1
MEM4: MEM.10 ; also sheet 1
MEM5: MEM.12 ; also sheet 1
MEM6: MEM.14 ; also sheet 1
MEM7: MEM.16 ; also sheet 1
MEM8: MEM.18 ; also sheet 1
MEM9: MEM.20 ; also sheet 1
MEM10: MEM.22 ; also sheet 1
MEM11: MEM.24 ; also sheet 1
NX0: ST.12 ; also sheet 1
NX1: ST.10 ; also sheet 1
NX2: ST.8 ; also sheet 1
NX3: ST.6 ; also sheet 1
NX4: ST.4 ; also sheet 1
NX5: ST.2 ; also sheet 1
PC0: PC.2 ; also sheet 1
PC1: PC.4 ; also sheet 1
PC2: PC.6 ; also sheet 1
PC3: PC.8 ; also sheet 1
PC4: PC.10 ; also sheet 1
PC5: PC.12 ; also sheet 1
PC6: PC.14 ; also sheet 1
PC7: PC.16 ; also sheet 1
PC8: PC.18 ; also sheet 1
PC9: PC.20 ; also sheet 1
PC10: PC.22 ; also sheet 1
PC11: PC.24 ; also sheet 1
R0: RXS.2 ; also sheet 1
R1: RXS.4 ; also sheet 1
R2: RXS.6 ; also sheet 1
R3: RXS.8 ; also sheet 1
RESET*: FPCTL.10 R32.1 ; also sheet 1
S0: RXS.16 ; also sheet 1
S1: RXS.18 ; also sheet 1
S3: RXS.22 ; also sheet 1
SINGLE*: FPCTL.12 R33.1 ; also sheet 1
ST0: ST.24 ; also sheet 1
ST1: ST.22 ; also sheet 1
ST2: ST.20 ; also sheet 1
ST3: ST.18 ; also sheet 1
ST4: ST.16 ; also sheet 1
ST5: ST.14 ; also sheet 1
SW0: R16.1 SW.2 ; also sheet 1
SW1: R17.1 SW.4 ; also sheet 1
SW2: R18.1 SW.6 ; also sheet 1
SW3: R19.1 SW.8 ; also sheet 1
SW4: R20.1 SW.10 ; also sheet 1
SW5: R21.1 SW.12 ; also sheet 1
SW6: R22.1 SW.14 ; also sheet 1
SW7: R23.1 SW.16 ; also sheet 1
SW8: R24.1 SW.18 ; also sheet 1
SW9: R25.1 SW.20 ; also sheet 1
SW10: R26.1 SW.22 ; also sheet 1
SW11: R27.1 SW.24 ; also sheet 1
UCODE: R1.2 ; also sheet 1
VCC [Power]: C10.1 C11.1 C12.1 C13.1 C14.1 C15.1 C16.1 C17.1 C18.1 C19.1 C20.1 C21.1 C22.1 C23.1 C24.1 C25.1 C26.1 C27.1 C28.1 C29.1 C30.1 C31.1 C32.1 C33.1 C34.1 C35.1 C36.1 C37.1 C38.1 C39.1 C40.1 C41.1 C42.1 C43.1 C44.1 C45.1 C46.1 C47.1 C48.1 C49.1 C50.1 C51.1 C52.1 J1.1 R1.1 R4.2 R5.2 R6.2 R7.2 R8.2 R9.2 R10.2 R11.2 R12.2 R13.2 R14.2 R15.2 R16.2 R17.2 R18.2 R19.2 R20.2 R21.2 R22.2 R23.2 R24.2 R25.2 R26.2 R27.2 R28.2 R29.2 R30.2 R31.2 R32.2 R33.2 R34.2 R35.2 R36.2 R37.2 R38.2 R39.2 R40.2 R43.2 R44.2 R45.2 R46.2 ; also sheet 1
X0: RXS.10 ; also sheet 1
X1: RXS.12 ; also sheet 1
X2: RXS.14 ; also sheet 1
Unconnected: IOCTL.16 IOCTL.18 IOCTL.20

### Notes on the sheet
- Connectors, Supply, etc.

## Power pins joined to a net without a drawn wire
GND: A0.8(GND) A1.8(GND) A2.8(GND) A3.8(P:GND) B4.12(GND) B5.12(GND) B6.12(GND) B7.10(GND) B8.12(GND) B9.12(GND) B10.12(GND) B11.12(GND) C0.4(GND) C1.10(GND) C2.10(GND) C3.10(GND) C4.12(GND) C6.12(GND) C9.12(GND) D0.12(GND) D1.12(GND) D2.12(GND) D3.12(GND) D4.12(GND) D5.12(GND) D6.12(GND) D7.12(GND) D8.12(GND) D9.12(GND) D10.12(GND) D11.12(GND) E0.7(P:GND) E1.7(P:GND) E2.7(P:GND) E3.7(P:GND) E4.7(P:GND) E5.7(P:GND) E6.7(P:GND) E11.7(P:GND)
VCC: A0.16(VCC) A1.16(VCC) A2.16(VCC) A3.16(P:VCC) B4.24(VCC) B5.24(VCC) B6.24(VCC) B7.20(VCC) B8.24(VCC) B9.24(VCC) B10.24(VCC) B11.24(VCC) C0.8(VCC) C1.20(VCC) C2.20(VCC) C3.20(VCC) C4.24(VCC) C6.24(VCC) C9.24(VCC) D0.24(VCC) D1.24(VCC) D2.24(VCC) D3.24(VCC) D4.24(VCC) D5.24(VCC) D6.24(VCC) D7.24(VCC) D8.24(VCC) D9.24(VCC) D10.24(VCC) D11.24(VCC) E0.14(P:VCC) E1.14(P:VCC) E2.14(P:VCC) E3.14(P:VCC) E4.14(P:VCC) E5.14(P:VCC) E6.14(P:VCC) E11.14(P:VCC)

## Library data of the parts
A0 = 74xx-us:74*175: Qadruple D type FLIP FLOP, clear
A1 = 74xx-us:74*194: 4-bit bidirectional SHIFT REGISTER
A2 = 74xx-us:74*151: Data SELECTOR/MULTIPLEXER
A3 = 74xx-us:74*109: Dual J-K positive edge triggered FLIP FLOP, preset and clear
B4-B6 B8-B11 D0 D1-D11 = pal:22V10: PAL; MPN: GAL22V10D-7LPN; OC_FARNELL: 1571925; OC_NEWARK: 97M0480
B7 = 74xx-us:74*273: Octal D type FLIP FLOP, clear
C0 = maxim:MXD1000: DELAY LINE; OC_FARNELL: unknown; OC_NEWARK: unknown
C1-C3 = memory:51C68: MEMORY
C4 C6 C9 = 74xx-us:74*181: ARITHMETIC LOGIC UNIT function generator
C10-C52 = rcl:C-US: CAPACITOR, American symbol
E0 = 74xx-us:74*00: Quad 2-input NAND gate
E1 = 74xx-us:74*02: Quad 2-input NOR gate
E2 E3 = 74xx-us:74*08: Quad 2-input AND gate
E4 = 74xx-us:74*10: Triple 3-input NAND gate
E5 = 74xx-us:74*32: Quad 2-input OR gate
E6 = 74xx-us:74*86: Quad 2-input EXCLUSIV-OR (XOR) gate
E7-E10 = 74ttl-din:74*4078: 8-input OR/NOR, complementary outputs
E11 = 74xx-us:74*25: Dual 4-input NOR gate, strobe
FPCTL IN IOCTL IR LAC LCH MA MB MEM PC RXS ST SW = con-harting-ml:ML26: HARTING; OC_FARNELL: unknown; OC_NEWARK: unknown
J1 J2 = jumper:J: Bridge
R1 R4-R40 R43-R46 = rcl:R-US_: RESISTOR, American symbol

## Net classes
1 Power: width 0.635 mm